# EAGLE design right board (EAGLE 8.6.1)
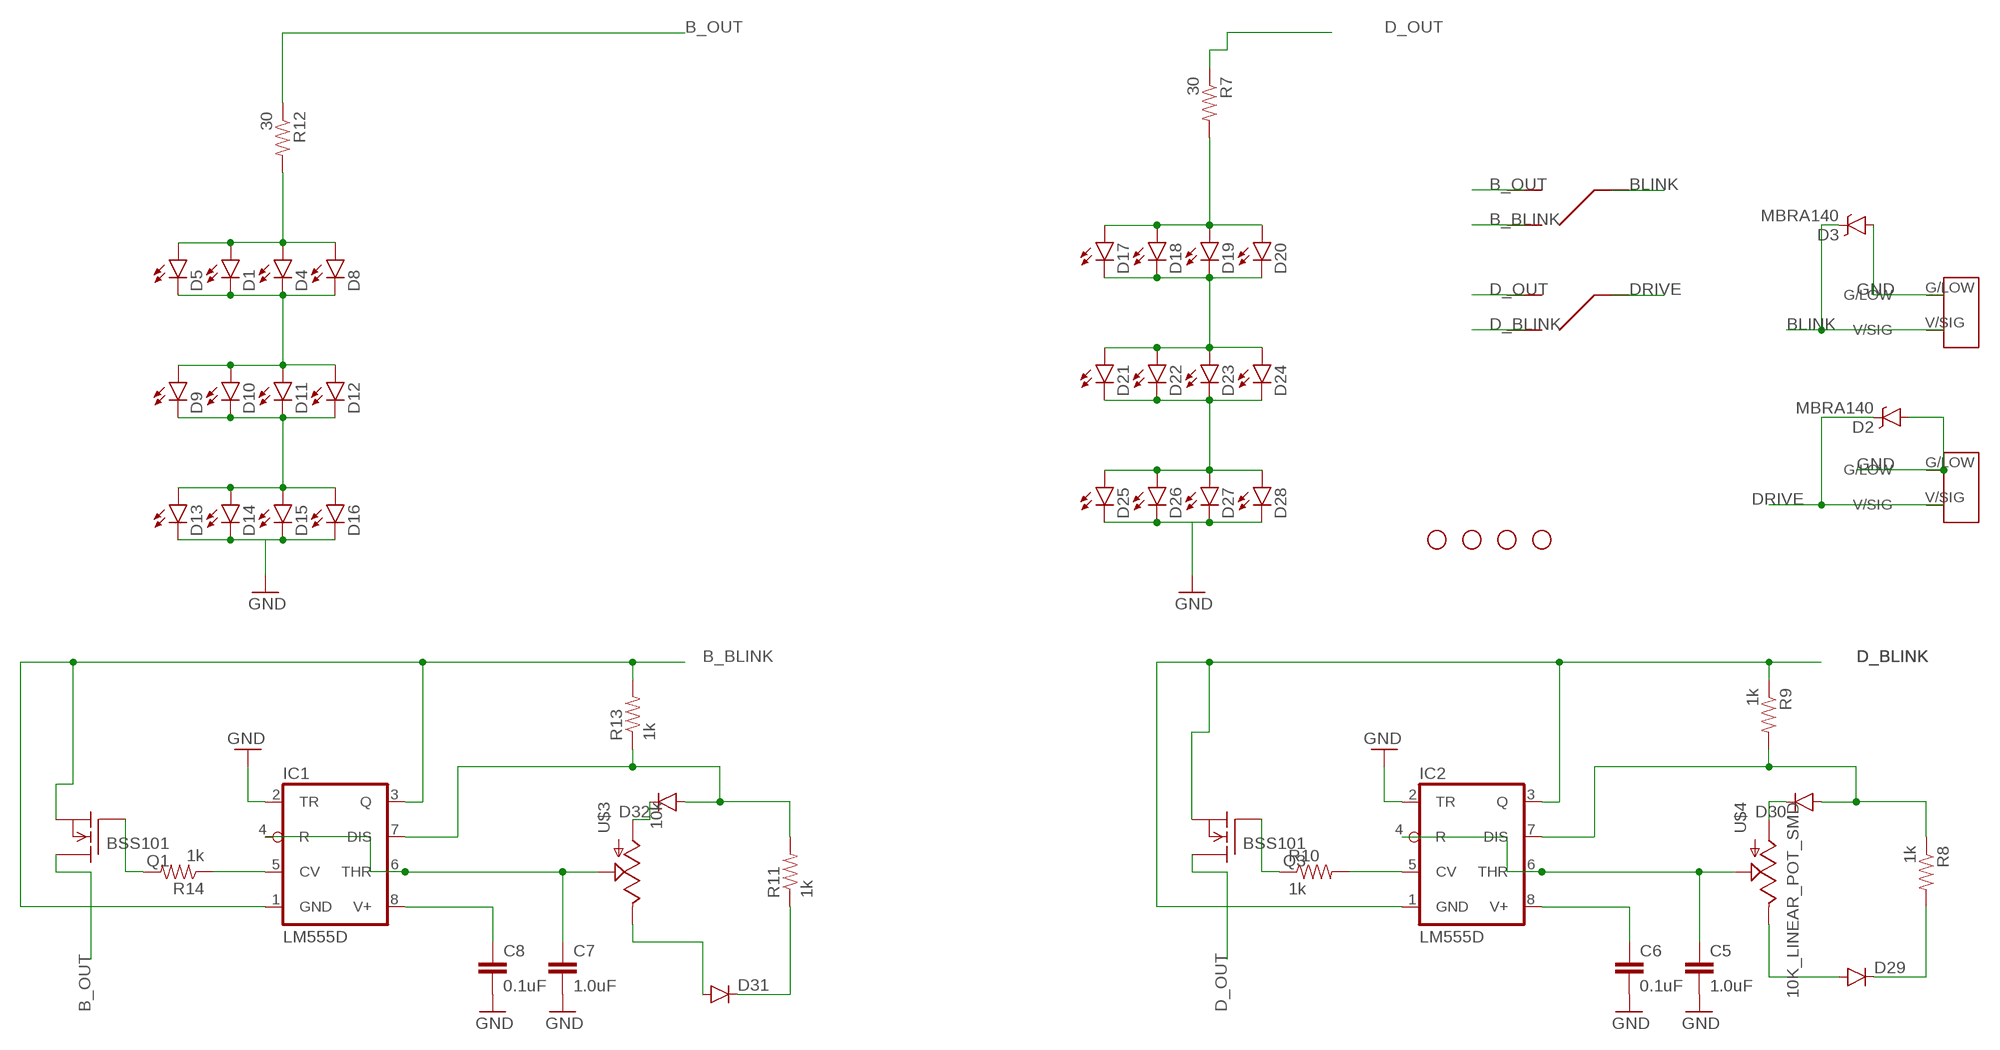
[diagram p0: schematic, sheet 1]

## Parts
C5  1.0uF  1.0UF-25V-+80/-20(0805)"  [0805-CAP]
C6  0.1uF  0.1UF-25V(+80/-20%)(0603)  [0603-CAP]
C7  1.0uF  1.0UF-25V-+80/-20(0805)"  [0805-CAP]
C8  0.1uF  0.1UF-25V(+80/-20%)(0603)  [0603-CAP]
D1  LED5MM  [LED5MM]
D2  MBRA140  [SMA-DIODE]
D3  MBRA140  [SMA-DIODE]
D4  LED5MM  [LED5MM]
D5  LED5MM  [LED5MM]
D8  LED5MM  [LED5MM]
D9  LED5MM  [LED5MM]
D10  LED5MM  [LED5MM]
D11  LED5MM  [LED5MM]
D12  LED5MM  [LED5MM]
D13  LED5MM  [LED5MM]
D14  LED5MM  [LED5MM]
D15  LED5MM  [LED5MM]
D16  LED5MM  [LED5MM]
D17  LED5MM  [LED5MM]
D18  LED5MM  [LED5MM]
D19  LED5MM  [LED5MM]
D20  LED5MM  [LED5MM]
D21  LED5MM  [LED5MM]
D22  LED5MM  [LED5MM]
D23  LED5MM  [LED5MM]
D24  LED5MM  [LED5MM]
D25  LED5MM  [LED5MM]
D26  LED5MM  [LED5MM]
D27  LED5MM  [LED5MM]
D28  LED5MM  [LED5MM]
D29  DIODESMA  [SMA-DIODE]
D30  DIODESMA  [SMA-DIODE]
D31  DIODESMA  [SMA-DIODE]
D32  DIODESMA  [SMA-DIODE]
H1  STAND-OFF  [STAND-OFF]
H2  STAND-OFF  [STAND-OFF]
H3  STAND-OFF  [STAND-OFF]
H4  STAND-OFF  [STAND-OFF]
IC1  LM555D  [SO08]
IC2  LM555D  [SO08]
Q1  BSS101  [TO92]
Q3  BSS101  [TO92]
R7  30  0.22OHM-1/4W-1%(0805)  [0805]
R8  1k  0.22OHM-1/4W-1%(0805)  [0805]
R9  1k  0.22OHM-1/4W-1%(0805)  [0805]
R10  1k  0.22OHM-1/4W-1%(0805)  [0805]
R11  1k  0.22OHM-1/4W-1%(0805)  [0805]
R12  30  0.22OHM-1/4W-1%(0805)  [0805]
R13  1k  0.22OHM-1/4W-1%(0805)  [0805]
R14  1k  0.22OHM-1/4W-1%(0805)  [0805]
U$1  JS_SERIES_SLIDESWITCCH  [MYPART3]
U$2  JS_SERIES_SLIDESWITCCH  [MYPART3]
U$3  10k  10K_LINEAR_POT_SMD  [TC33X]
U$4  10K_LINEAR_POT_SMD  [TC33X]
U$5  2_PIN_TECONNECTOR  [2_PIN_CONNECT]
U$6  2_PIN_TECONNECTOR  [2_PIN_CONNECT]

## Nets
B_BLINK: IC1.1(GND) IC1.3(Q) Q1.1(S) R13.2 U$1.OUT1
B_OUT: Q1.3(D) R12.1 U$1.OUT2
BLINK: D3.C U$1.IN U$5.V/SIG
D_BLINK: IC2.1(GND) IC2.3(Q) Q3.1(S) R9.1 U$2.OUT1
D_OUT: Q3.3(D) R7.1 U$2.OUT2
DRIVE: D2.C U$2.IN U$6.V/SIG
GND: C5.2 C6.2 C7.2 C8.2 D2.A D3.A D13.K(C) D14.K(C) D15.K(C) D16.K(C) D25.K(C) D26.K(C) D27.K(C) D28.K(C) IC1.2(TR) IC2.2(TR) U$5.G/LOW U$6.G/LOW
N$1: D29.A U$4.3(E)
N$2: C5.1 IC2.4(R) IC2.6(THR) U$4.2(S)
N$3: D32.C U$3.1(A)
N$4: D32.A IC1.7(DIS) R11.2 R13.1
N$5: D31.A U$3.3(E)
N$6: C8.1 IC1.8(V+)
N$7: D31.C R11.1
N$8: Q1.2(G) R14.2
N$9: D30.C U$4.1(A)
N$10: IC1.5(CV) R14.1
N$11: D1.K(C) D4.K(C) D5.K(C) D8.K(C) D9.A D10.A D11.A D12.A
N$12: C7.1 IC1.4(R) IC1.6(THR) U$3.2(S)
N$13: D1.A D4.A D5.A D8.A R12.2
N$14: D30.A IC2.7(DIS) R8.1 R9.2
N$15: C6.1 IC2.8(V+)
N$16: IC2.5(CV) R10.2
N$17: D17.K(C) D18.K(C) D19.K(C) D20.K(C) D21.A D22.A D23.A D24.A
N$18: D29.C R8.2
N$19: Q3.2(G) R10.1
N$20: D21.K(C) D22.K(C) D23.K(C) D24.K(C) D25.A D26.A D27.A D28.A
N$21: D9.K(C) D10.K(C) D11.K(C) D12.K(C) D13.A D14.A D15.A D16.A
N$22: D17.A D18.A D19.A D20.A R7.2

## Library data of the parts
C5 C7 = SparkFun-Capacitors-extra:1.0UF-25V-+80/-20(0805): CAP-11625; PROD_ID: CAP-11625
C6 C8 = SparkFun-Capacitors-extra:0.1UF-25V(+80/-20%)(0603): CAP-00810 Ceramic Standard decoupling cap; PROD_ID: CAP-00810
D1 D4 D5 D8-D28 = SparkFun-LED:LED: LEDs Standard schematic elements and footprints for 5mm, 3mm, 1206, and 0603 sized LEDs. 5mm - Spark Fun Electronics SKU : COM-00529 (and others)
D2 D3 = SparkFun-DiscreteSemi:MBRA140: 40V, 1A Schottky rectifier SMA/DO-214AC package DIO-08053; PROD_ID: DIO-08053
D29-D32 = SparkFun-DiscreteSemi:DIODE: Diode These are standard reverse protection diodes and small signal diodes. SMA package can handle up to about 1A. SOD-323 can handle about 200mA. What the SOD-323 package when ordering, there are some mfgs out there that are 5-pin packages.
H1-H4 = SparkFun-Electromechanical:STAND-OFF: #4 Stand Off This is the mechanical footprint for a #4 phillips button head screw. Use the keepout ring to avoid running the screw head into surrounding components. SKU : PRT-00447
IC1 IC2 = linear:*555: TIMER
Q1 Q3 = transistor-fet:BSS101: N-Channel Enhancement MOSFET 200V; 0,16A; 11Ohm
R7-R14 = SparkFun-Resistors:0.22OHM-1/4W-1%(0805): RES-09883; PROD_ID: RES-09883; VALUE: 0.22
U$1 U$2 = slide switch:JS_SERIES_SLIDESWITCCH: ON-ON 12V Sliding switch
U$3 U$4 = SparkFun-Resistors:10K_LINEAR_POT_SMD; PROD_ID: RES-12428
U$5 U$6 = TE 2-pin connector:2_PIN_TECONNECTOR: 2-pin connector for high power connections on board

## Board
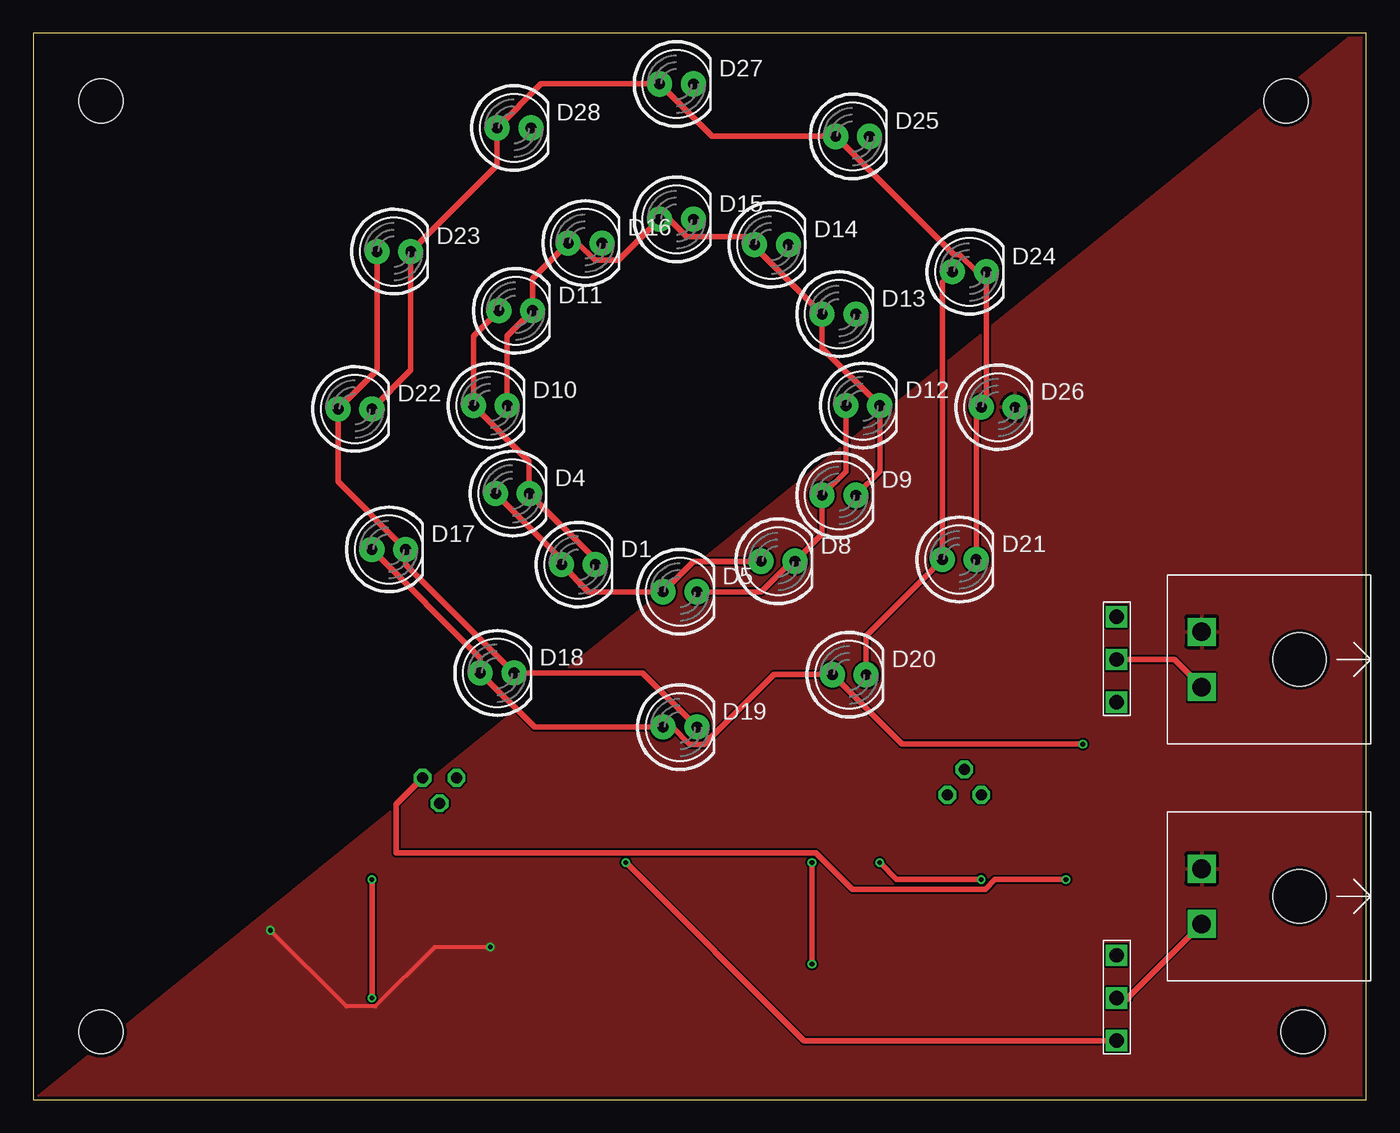
[diagram p1: board, top side]
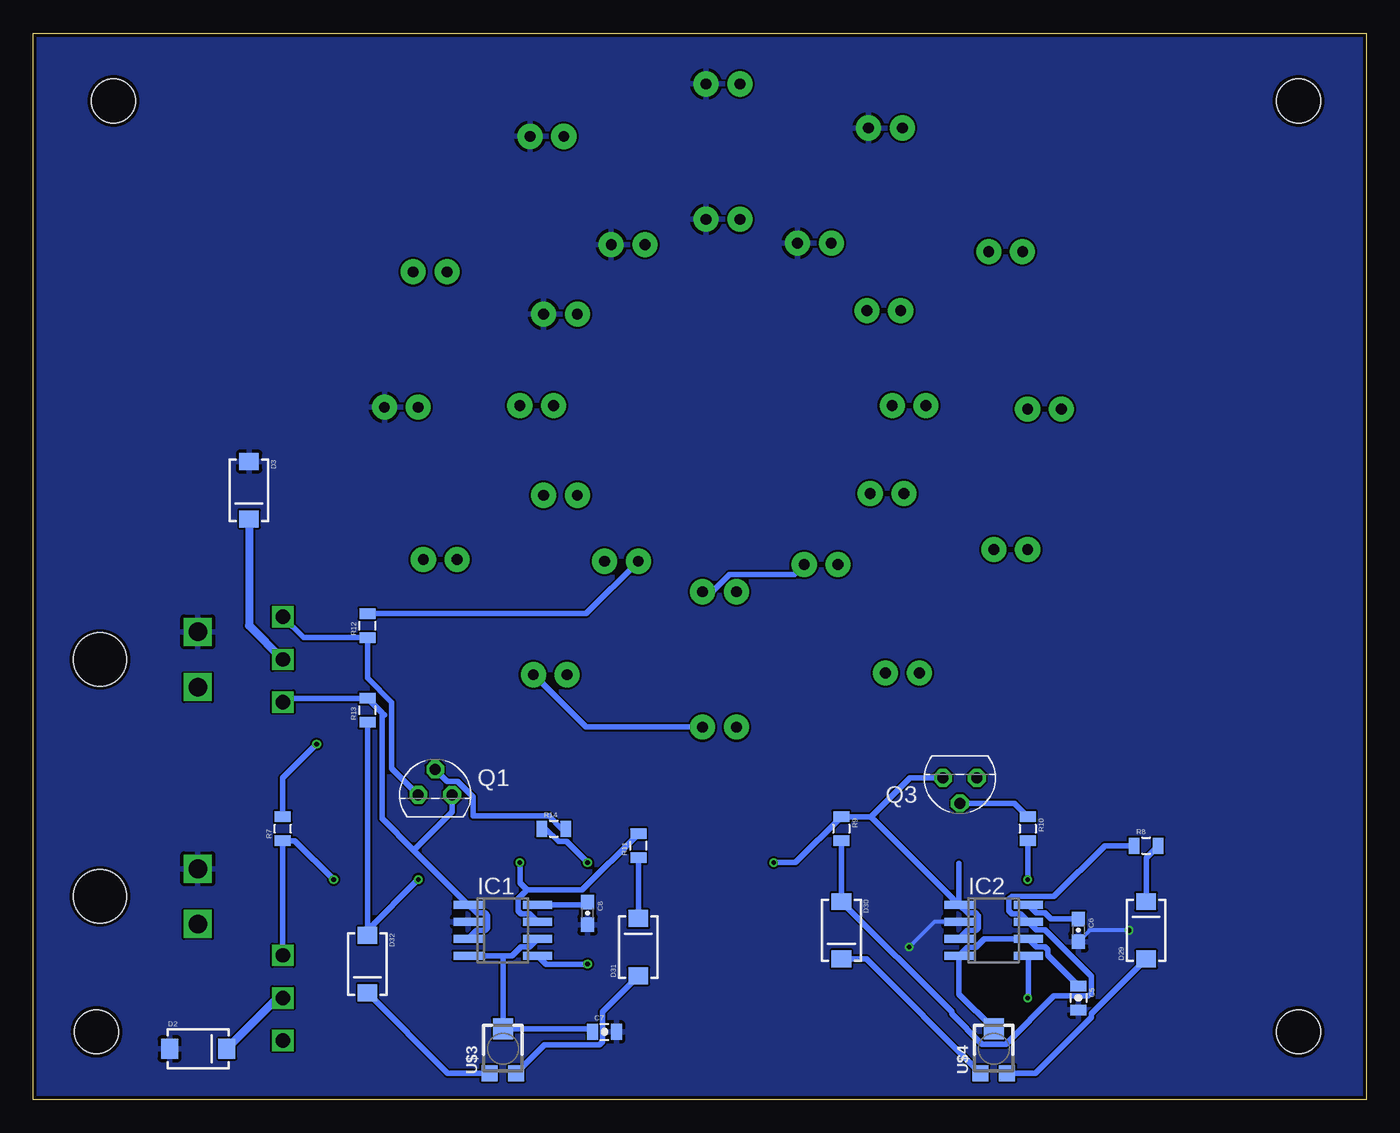
[diagram p2: board, bottom side, seen from below]

Size 100 x 80 mm. Coordinates in mm from the lower left corner, seen from the top.
Outline: 0,0 100,0 100,80 0,80 0,0
Copper layers (1*16): Top 0.035mm / dielectric 1.5mm / Bottom 0.035mm
Design rules "SeeedStudio_2layer_DRU_no_angle_20140221": minimum track width 6mil, minimum drill 12mil, track to track 6mil, track to pad 6mil, pad to pad 6mil, via to via 6mil, smd to smd 0mil, copper to edge 10mil, drill to drill 10mil, minimum pad ring 10mil, minimum via ring 6mil, stop-mask expansion 2mil, vias tented up to drill 100mil, thermal gap 10mil

### Footprints (pad centres in the part's own frame; a part is rotated, then mirrored left to right if it is on the bottom)
0805-CAP = smd 0.8 x 1.2: 1 -0.9,0; 2 0.9,0
0603-CAP = smd 1.1 x 1: 1 -0.85,0; 2 0.85,0
LED5MM = drill 0.813 pad 1.88: A -1.27,0; K 1.27,0
SMA-DIODE = smd 1.27 x 1.47: A -2.15,0; C 2.15,0
STAND-OFF = hole 3.302: 0,0
SO08 = smd 0.6 x 2.2: 1 -1.905,-2.6; 2 -0.635,-2.6; 3 0.635,-2.6; 4 1.905,-2.6; 5 1.905,2.6; 6 0.635,2.6; 7 -0.635,2.6; 8 -1.905,2.6
TO92 = drill 0.813 octagon: 1 1.27,0; 2 0,1.905; 3 -1.27,0
0805 = smd 0.8 x 1.2: 1 -0.9,0; 2 0.9,0
MYPART3 = drill 1.067 square: IN 0,0; OUT1 -3.2,0; OUT2 3.2,0
TC33X = smd 1.2 x 1.2: 1 -1,-1.825; 3 1,-1.825 | smd 1.5 x 1.6: 2 0,1.5
2_PIN_CONNECT = drill 1.4 square: G/LOW 2.07,12.67; V/SIG -2.07,12.67 | hole 4: 0,5.33

### Placement (x,y rotation side)
C5  21.59,7.62 270 bottom
C6  21.59,12.7 270 bottom
C7  57.15,5.08 0 bottom
C8  58.42,13.97 270 bottom
D1  40.89,40.13 0 top
D2  87.63,3.81 0 bottom
D3  83.82,45.72 270 bottom
D4  35.94,45.47 0 top
D5  48.51,38.1 0 top
D8  55.88,40.39 0 top
D9  60.45,45.34 0 top
D10  34.29,52.07 0 top
D11  36.2,59.18 0 top
D12  62.23,52.07 0 top
D13  60.45,58.93 0 top
D14  55.37,64.14 0 top
D15  48.26,66.04 0 top
D16  41.4,64.26 0 top
D17  26.67,41.27 0 top
D18  34.8,32 0 top
D19  48.51,27.94 0 top
D20  61.21,31.88 0 top
D21  69.47,40.51 0 top
D22  24.13,51.82 0 top
D23  27.05,63.63 0 top
D24  70.23,62.1 0 top
D25  61.47,72.26 0 top
D26  72.39,51.94 0 top
D27  48.26,76.2 0 top
D28  36.07,72.9 0 top
D29  16.51,12.7 90 bottom
D30  39.37,12.7 270 bottom
D31  54.61,11.43 90 bottom
D32  74.93,10.16 270 bottom
H1  5.08,5.08 0 top
H2  5.08,74.93 0 top
H3  93.98,74.93 0 top
H4  95.25,5.08 0 top
IC1  64.77,12.7 270 bottom
IC2  27.94,12.7 270 bottom
Q1  69.85,22.86 0 bottom
Q3  30.48,24.13 180 bottom
R7  81.28,20.32 90 bottom
R8  16.51,19.05 0 bottom
R9  39.37,20.32 270 bottom
R10  25.4,20.32 270 bottom
R11  54.61,19.05 90 bottom
R12  74.93,35.56 90 bottom
R13  74.93,29.21 90 bottom
R14  60.96,20.32 0 bottom
U$1  81.28,33.02 90 top
U$2  81.28,7.62 90 top
U$3  64.77,3.81 0 bottom
U$4  27.94,3.81 0 bottom
U$5  100.33,33.02 90 top
U$6  100.33,15.24 90 top

### Tracks (layer width: path | path; a pad name or v marks a point on that pad's centre or on a via)
B_BLINK
  Bottom 0.406: IC1.3 66.76,12.68 66.12,12.68 65.91,12.89 65.91,13.78 66.04,13.91 66.04,13.97 66.1,13.97 66.12,13.99 66.76,13.99 IC1.1 71.47,18.7 | 73.66,28.84 73.84,29.02 | 73.84,29.02 R13.2 80.99,30.11 U$1.OUT1 | Q1.1 68.58,21.59 71.47,18.7 | 73.84,29.02 73.84,21.08 71.47,18.7
B_OUT
  Bottom 0.406: U$1.OUT2 79.72,34.66 R12.1 74.93,31.61 73.1,29.78 73.1,24.84 Q1.3
BLINK
  Top 0.406: 81.75,33.49 U$1.IN 85.59,33.02 U$5.V/SIG
  Bottom 0.61: D3.C 83.82,35.56 U$1.IN
D_BLINK  (via drill 0.35)
  Top 0.406: U$2.OUT1 57.81,4.42 v44.45,17.78
  Bottom 0.406: v44.45,17.78 42.81,17.78 R9.1 37.16,21.22 | 37.16,21.22 IC2.1 | IC2.1 30.54,17.72 | IC2.1 29.93,13.99 29.29,13.99 29.08,13.78 29.08,12.89 29.29,12.68 29.93,12.68 IC2.3 | 37.16,21.22 34.24,24.13 Q3.1
D_OUT  (via drill 0.35)
  Top 0.406: v77.47,16.51 72.16,16.51 71.42,15.78 61.46,15.78 58.72,18.51 27.21,18.51 27.21,22.13 Q3.3
  Bottom 0.406: U$2.OUT2 R7.1 80.38,19.42 v77.47,16.51
DRIVE
  Top 0.406: 82.11,7.62 U$6.V/SIG
  Top 0.61: U$2.IN 82.11,7.62
  Bottom 0.61: U$2.IN 81.67,7.62 D2.C
GND  (via drill 0.35)
  Top 0.305: v34.29,11.43 30.1,11.43 25.66,6.99 23.49,6.99 v17.78,12.7
  Bottom 0.305: IC2.2 32.38,13.34 v34.29,11.43 | v17.78,12.7 20.74,12.7 C6.2
  pour Top: 99.06,80.01 100.08,80.01 100.08,0 0,0
  pour Bottom: 0,80.01 100.33,80.01 100.33,0 0,0
N$1
  Bottom 0.406: D29.A 20.63,6.43 20.63,6.17 24.82,1.99 U$4.3
N$2
  Bottom 0.406: C5.1 23.88,10.81 23.88,11.24 24.09,11.45 24.73,11.45 IC2.6 28.64,12.06 29.29,11.41 29.93,11.41 IC2.4 30.54,7.91 U$4.2
N$3
  Bottom 0.406: U$3.1 68.91,1.99 D32.C
N$4  (via drill 0.35)
  Top 0.406: v71.12,16.51 64.77,16.51 v63.5,17.78
  Bottom 0.406: R13.1 D32.A 74.93,12.7 v71.12,16.51 | R11.2 58.83,15.73 62.95,15.73 | 62.95,15.73 63.63,15.05 63.63,14.16 63.42,13.95 62.78,13.95 IC1.7 | v63.5,17.78 63.5,16.27 62.95,15.73
N$5
  Bottom 0.406: U$3.3 61.63,4.12 57.5,4.12 57.29,4.33 57.29,6.6 D31.A
N$6
  Bottom 0.406: IC1.8 58.63,14.61 C8.1
N$7
  Bottom 0.406: R11.1 D31.C
N$8
  Bottom 0.406: R14.2 60.36,20.32 61.31,21.28 67,21.28 67,22.71 68.16,23.88 68.96,23.88 Q1.2
N$9
  Bottom 0.406: D30.C 37.51,10.55 U$4.1
N$10  (via drill 0.35)
  Top 0.406: v58.42,17.78 v58.42,10.16
  Bottom 0.406: v58.42,17.78 60,19.36 60.61,19.36 61.56,20.32 R14.1 | v58.42,10.16 61.53,10.16 IC1.5
N$11
  Top 0.406: D12.A 60.96,47.12 D9.A 59.18,42.42 D8.K 56.9,40.39 54.61,38.1 D5.K | D1.K 42.16,40.51 D4.K 37.21,47.88 D10.A 33.02,57.28 D11.A
  Bottom 0.406: D5.K 49.08,38.1 47.78,39.4 42.9,39.4 D1.K
N$12
  Bottom 0.406: IC1.6 62.78,11.45 63.42,11.45 64.07,10.79 64.77,10.79 | IC1.4 64.77,10.79 | 64.77,10.79 U$3.2 58.28,5.31 C7.1
N$13
  Top 0.406: D8.A 49.53,40.39 D5.A 41.66,38.1 D1.A 39.62,40.51 D4.A
  Bottom 0.406: R12.2 58.54,36.46 D8.A
N$14
  Bottom 0.406: R9.2 D30.A 31.1,6.58 31.1,6.42 28.84,4.15 27.04,4.15 23.43,7.76 20.84,7.76 20.63,7.97 20.63,9.26 24.09,12.72 24.73,12.72 IC2.7 25.95,13.95 26.59,13.95 26.8,14.16 26.8,15.05 26.59,15.26 23.41,15.26 19.62,19.05 R8.1
N$15
  Bottom 0.406: IC2.8 24.73,13.99 24.09,13.99 23.65,13.55 C6.1
N$16  (via drill 0.35)
  Top 0.406: v25.4,7.62 v25.4,16.51
  Bottom 0.406: IC2.5 25.34,7.68 v25.4,7.62 | v25.4,16.51 R10.2
N$17
  Top 0.406: D20.K 62.48,34.8 D21.A 68.2,61.34 D24.A | D23.A 25.78,54.74 D22.A 22.86,46.35 D17.K 27.94,40.13 D18.K 45.72,32 D19.K
  Bottom 0.406: D19.K 58.55,27.94 D20.K
N$18
  Bottom 0.406: D29.C 16.51,18.15 R8.2
N$19
  Bottom 0.406: R10.1 26.41,22.23 Q3.2
N$20
  Top 0.406: D21.K 70.74,51.56 71.11,51.93 | 71.11,51.93 D26.A | 71.11,51.93 71.5,52.32 D24.K 70.79,62.1 69.5,63.4 69.06,63.4 D25.A 50.93,72.26 D27.A 38.1,76.2 D28.A 34.8,70.1 D23.K 28.32,54.74 D22.K
N$21
  Top 0.406: D9.K 63.5,47.12 D12.K 59.18,56.39 D13.A 54.1,64.01 D14.A 53.49,64.75 48.99,64.75 47.7,66.04 D15.A 43.92,62.97 42.13,62.97 40.84,64.26 D16.A 37.47,61.59 D11.K 35.56,57.28 D10.K
N$22  (via drill 0.35)
  Top 0.406: v78.74,26.67 65.15,26.67 D20.A 55.55,31.88 50.32,26.64 49.25,26.64 47.95,27.94 D19.A 37.59,27.94 D18.A 33.53,33.15 D17.A
  Bottom 0.406: R7.2 81.28,24.13 v78.74,26.67